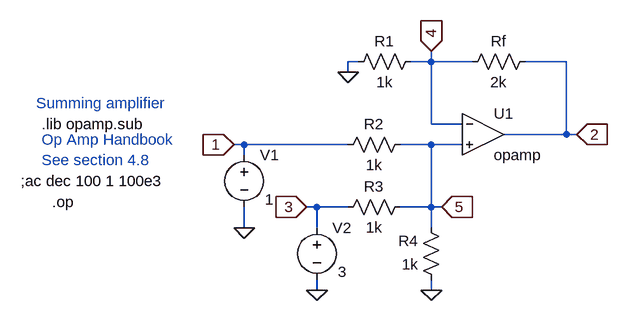
[diagram p0: schematic summing amplifier.asc]
summing amplifier.asc, the LTspice schematic file:
Version 4
SHEET 1 880 680
WIRE 0 32 -16 32
WIRE 112 32 112 16
WIRE 112 32 80 32
WIRE 176 32 112 32
WIRE 320 32 256 32
WIRE -16 48 -16 32
WIRE 112 128 112 32
WIRE 160 128 112 128
WIRE 320 144 320 32
WIRE 320 144 224 144
WIRE 336 144 320 144
WIRE -176 160 -192 160
WIRE -16 160 -176 160
WIRE 112 160 64 160
WIRE 160 160 112 160
WIRE -176 176 -176 160
WIRE -64 256 -80 256
WIRE -16 256 -64 256
WIRE 112 256 112 160
WIRE 112 256 64 256
WIRE 128 256 112 256
WIRE -176 288 -176 256
WIRE -64 288 -64 256
WIRE 112 288 112 256
WIRE -64 384 -64 368
WIRE 112 384 112 368
FLAG 112 384 0
FLAG -192 160 1
IOPIN -192 160 In
FLAG 128 256 5
IOPIN 128 256 In
FLAG 112 16 4
IOPIN 112 16 In
FLAG 336 144 2
IOPIN 336 144 In
FLAG -80 256 3
IOPIN -80 256 In
FLAG -16 48 0
FLAG -176 288 0
FLAG -64 384 0
SYMBOL OpAmps\\opamp 192 80 R0
SYMATTR InstName U1
SYMBOL voltage -176 160 R0
WINDOW 123 27 88 Left 2
WINDOW 39 0 0 Left 0
WINDOW 3 32 84 Left 2
SYMATTR Value 1
SYMATTR InstName V1
SYMBOL res 96 16 R90
WINDOW 0 0 56 VBottom 2
WINDOW 3 32 56 VTop 2
SYMATTR InstName R1
SYMATTR Value 1k
SYMBOL res 272 16 R90
WINDOW 0 0 56 VBottom 2
WINDOW 3 32 56 VTop 2
SYMATTR InstName Rf
SYMATTR Value 2k
SYMBOL res 128 384 R180
WINDOW 0 36 76 Left 2
WINDOW 3 36 40 Left 2
SYMATTR InstName R4
SYMATTR Value 1k
SYMBOL res 80 240 R90
WINDOW 0 0 56 VBottom 2
WINDOW 3 32 56 VTop 2
SYMATTR InstName R3
SYMATTR Value 1k
SYMBOL voltage -64 272 R0
WINDOW 123 27 88 Left 2
WINDOW 39 0 0 Left 0
WINDOW 3 32 84 Left 2
SYMATTR Value 3
SYMATTR InstName V2
SYMBOL res 80 144 R90
WINDOW 0 0 56 VBottom 2
WINDOW 3 32 56 VTop 2
SYMATTR InstName R2
SYMATTR Value 1k
TEXT -488 128 Left 2 !.lib opamp.sub
TEXT -488 152 Left 2 ;Op Amp Handbook\nSee section 4.8
TEXT -520 216 Left 2 !;ac dec 100 1 100e3
TEXT -496 96 Left 2 ;Summing amplifier
TEXT -472 248 Left 2 !.op

The netlist it stands for:
* summing amplifier.asc
XU1 4 5 2 opamp Aol=100K GBW=10Meg  ; pins invin noninvin out
V1 1 0 1
R1 4 0 1k
Rf 2 4 2k
R4 0 5 1k
R3 5 3 1k
V2 3 0 3
R2 5 1 1k
.lib opamp.sub
* Op Amp Handbook
* See section 4.8
;ac dec 100 1 100e3
* Summing amplifier
.op
.backanno
.end